# EAGLE design LampanRGBLed (EAGLE 5.06)
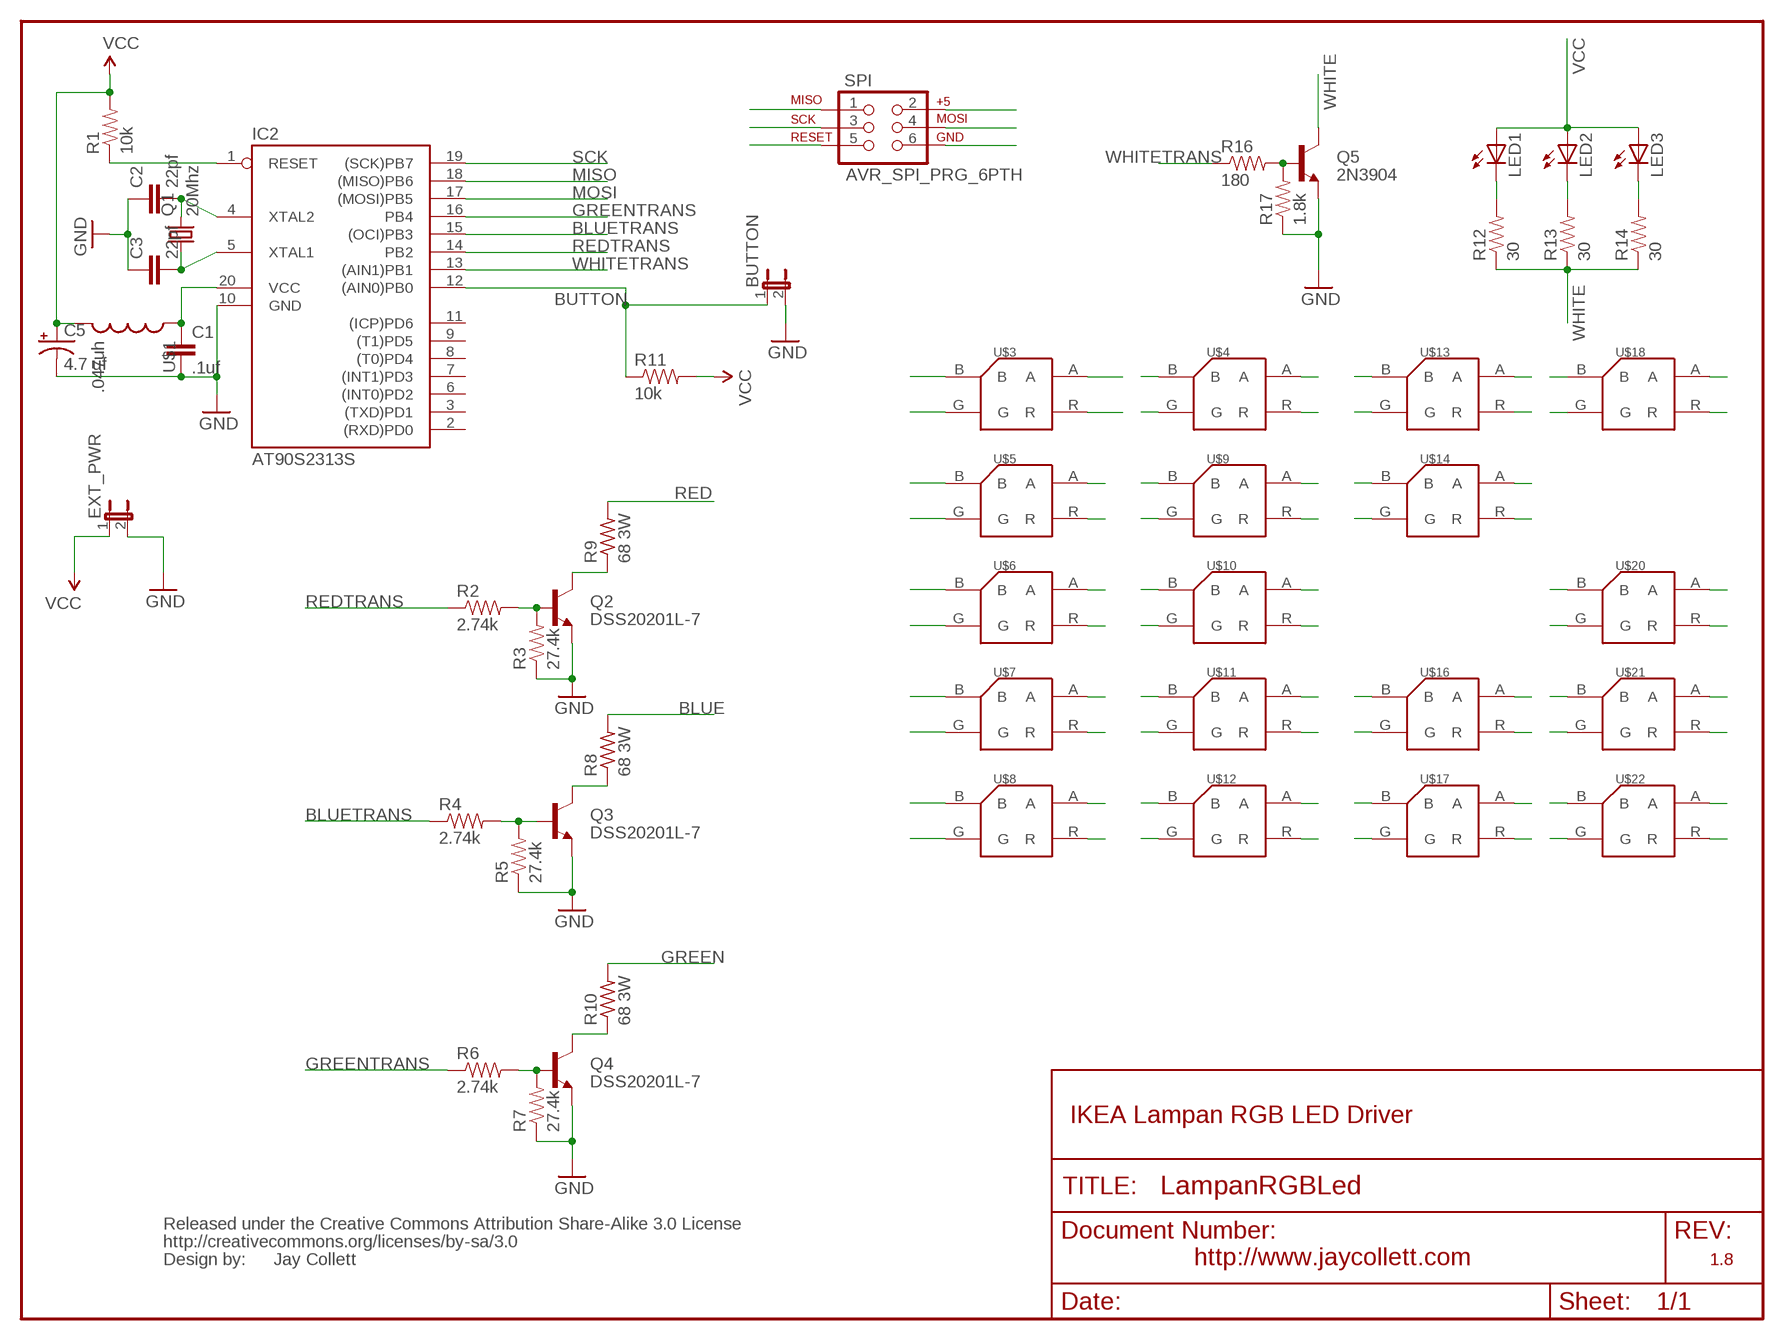
[diagram p0: schematic, sheet 1]

## Parts
BUTTON  JUMPER-2PTH  [1X02]
C1  .1uf  CAP0603-CAP  [0603-CAP]
C2  22pf  CAP0603-CAP  [0603-CAP]
C3  22pf  CAP0603-CAP  [0603-CAP]
C5  4.7 uf  CAP_POL1206  [EIA3216]
EXT_PWR  JUMPER-2PTH  [1X02]
IC2  AT90S2313S  [SO20L]
LED1  LED5MM  [LED5MM]
LED2  LED5MM  [LED5MM]
LED3  LED5MM  [LED5MM]
Q1  20Mhz  CRYSTALHC49UV  [HC49U-V]
Q2  DSS20201L-7  TRANSISTOR_NPNSOT23  [SOT23]
Q3  DSS20201L-7  TRANSISTOR_NPNSOT23  [SOT23]
Q4  DSS20201L-7  TRANSISTOR_NPNSOT23  [SOT23]
Q5  2N3904  TRANSISTOR_NPNSOT23  [SOT23]
R1  10k  RESISTOR  [0805]
R2  2.74k  RESISTOR  [0805]
R3  27.4k  RESISTOR  [0805]
R4  2.74k  RESISTOR  [0805]
R5  27.4k  RESISTOR  [0805]
R6  2.74k  RESISTOR  [0805]
R7  27.4k  RESISTOR  [0805]
R8  68 3W  R-US_0617/5V  [0617V]
R9  68 3W  R-US_0617/5V  [0617V]
R10  68 3W  R-US_0617/5V  [0617V]
R11  10k  RESISTOR  [0805]
R12  30  RESISTOR  [0805]
R13  30  RESISTOR  [0805]
R14  30  RESISTOR  [0805]
R16  180  RESISTOR  [0805]
R17  1.8k  RESISTOR  [0805]
SPI  AVR_SPI_PRG_6PTH  [2X3]
U$1  .047uh  INDUCTOR1210  [1210]
U$3  5MMRGBSUPERFLUXLED4PIN5MM  [4-PIN5MM]
U$4  5MMRGBSUPERFLUXLED4PIN5MM  [4-PIN5MM]
U$5  5MMRGBSUPERFLUXLED4PIN5MM  [4-PIN5MM]
U$6  5MMRGBSUPERFLUXLED4PIN5MM  [4-PIN5MM]
U$7  5MMRGBSUPERFLUXLED4PIN5MM  [4-PIN5MM]
U$8  5MMRGBSUPERFLUXLED4PIN5MM  [4-PIN5MM]
U$9  5MMRGBSUPERFLUXLED4PIN5MM  [4-PIN5MM]
U$10  5MMRGBSUPERFLUXLED4PIN5MM  [4-PIN5MM]
U$11  5MMRGBSUPERFLUXLED4PIN5MM  [4-PIN5MM]
U$12  5MMRGBSUPERFLUXLED4PIN5MM  [4-PIN5MM]
U$13  5MMRGBSUPERFLUXLED4PIN5MM  [4-PIN5MM]
U$14  5MMRGBSUPERFLUXLED4PIN5MM  [4-PIN5MM]
U$16  5MMRGBSUPERFLUXLED4PIN5MM  [4-PIN5MM]
U$17  5MMRGBSUPERFLUXLED4PIN5MM  [4-PIN5MM]
U$18  5MMRGBSUPERFLUXLED4PIN5MM  [4-PIN5MM]
U$20  5MMRGBSUPERFLUXLED4PIN5MM  [4-PIN5MM]
U$21  5MMRGBSUPERFLUXLED4PIN5MM  [4-PIN5MM]
U$22  5MMRGBSUPERFLUXLED4PIN5MM  [4-PIN5MM]
U$23  CREATIVE_COMMONS  [CREATIVE_COMMONS]

## Nets
BLUE: R8.2 U$3.B U$4.B U$5.B U$6.B U$7.B U$8.B U$9.B U$10.B U$11.B U$12.B U$13.B U$14.B U$16.B U$17.B U$18.B U$20.B U$21.B U$22.B
BLUETRANS: IC2.15((OCI)PB3) R4.1
BUTTON: BUTTON.1 IC2.12((AIN0)PB0) R11.1
GND: BUTTON.2 C1.2 C2.1 C3.1 C5.C(-) EXT_PWR.2 IC2.10(GND) Q2.2(E) Q3.2(E) Q4.2(E) Q5.2(E) R3.1 R5.1 R7.1 R17.1 SPI.6
GREEN: R10.2 U$3.G U$4.G U$5.G U$6.G U$7.G U$8.G U$9.G U$10.G U$11.G U$12.G U$13.G U$14.G U$16.G U$17.G U$18.G U$20.G U$21.G U$22.G
GREENTRANS: IC2.16(PB4) R6.1
MISO: IC2.18((MISO)PB6) SPI.1
MOSI: IC2.17((MOSI)PB5) SPI.4
N$1: Q2.1(B) R2.2 R3.2
N$2: Q3.1(B) R4.2 R5.2
N$3: Q4.1(B) R6.2 R7.2
N$4: C2.2 IC2.4(XTAL2) Q1.2
N$5: C3.2 IC2.5(XTAL1) Q1.1
N$6: Q2.3(C) R9.1
N$7: Q3.3(C) R8.1
N$8: Q4.3(C) R10.1
N$9: C1.1 IC2.20(VCC) U$1.1
N$10: LED1.K(C) R12.2
N$11: LED2.K(C) R13.2
N$12: LED3.K(C) R14.2
N$14: Q5.1(B) R16.2 R17.2
RED: R9.2 U$3.R U$4.R U$5.R U$6.R U$7.R U$8.R U$9.R U$10.R U$11.R U$12.R U$13.R U$14.R U$16.R U$17.R U$18.R U$20.R U$21.R U$22.R
REDTRANS: IC2.14(PB2) R2.1
RST: IC2.1(RESET) R1.1 SPI.5
SCK: IC2.19((SCK)PB7) SPI.3
VCC: C5.A(+) EXT_PWR.1 LED1.A LED2.A LED3.A R1.2 R11.2 SPI.2 U$1.2 U$3.A U$4.A U$5.A U$6.A U$7.A U$8.A U$9.A U$10.A U$11.A U$12.A U$13.A U$14.A U$16.A U$17.A U$18.A U$20.A U$21.A U$22.A
WHITE: Q5.3(C) R12.1 R13.1 R14.1
WHITETRANS: IC2.13((AIN1)PB1) R16.1
Unconnected: IC2.2((RXD)PD0) IC2.3((TXD)PD1) IC2.6((INT0)PD2) IC2.7((INT1)PD3) IC2.8((T0)PD4) IC2.9((T1)PD5) IC2.11((ICP)PD6)

## Notes on the sheet
- IKEA Lampan RGB LED Driver
- Jay Collett | http://www.jaycollett.com | 1.8

## Library data of the parts
BUTTON EXT_PWR = SparkFun:JUMPER-2: Jumper Basic 0.1" spaced jumper. Use with breakaway headers.
C1-C3 = SparkFun:CAP: Capacitor Standard 0603 ceramic capacitor, and 0.1" leaded capacitor.
C5 = SparkFun:CAP_POL: Capacitor Polarized These are standard SMD and PTH capacitors. Normally 10uF, 47uF, and 100uF in electrolytic and tantalum varieties. Always verify the external diameter of the through hole cap, it varies with capacity, voltage, and manufacturer. The EIA devices should be standard.
IC2 = atmel:AT90S2313: MICROCONTROLLER 2 Kbytes FLASH 128 bytes SRAM 128 bytes EEPROM UART
LED1-LED3 = SparkFun:LED: LEDs Standard schematic elements and footprints for 5mm, 3mm, 1206, and 0603 sized LEDs. 5mm - Spark Fun Electronics SKU : COM-00529 (and others)
Q1 = SparkFun:CRYSTAL: Crystals Various standard crystals. Proven footprints. Spark Fun Electronics SKU : COM-00534
Q2-Q5 = SparkFun:TRANSISTOR_NPN: Transistor NPN BJT configuration in SOT23 package. MMBT2222 is the common NPN we use. Double check BCE configuration again layout.
R1-R7 R11-R14 R16 R17 = SparkFun:RESISTOR: Resistor Basic schematic elements and footprints for 0603, 1206, and PTH 1/10th watt (small) resistors.
R8-R10 = rcl:R-US_: RESISTOR, American symbol
SPI = SparkFun:AVR_SPI_PRG_6: AVR ISP 6 Pin This is the reduced ISP connector for AVR programming. Common on Arduino. This footprint will take up less PCB space and can be used with a 10-pin to 6-pin adapter such as SKU: BOB-08508
U$1 = SparkFun:INDUCTOR: Inductors Basic Inductor/Choke - 0603 and 1206. Footprints are not proven and vary greatly between part numbers.
U$3-U$14 U$16-U$18 U$20-U$22 = JayCollett-com:5MMRGBSUPERFLUXLED: Custom Eagle Part for 5MM RGB Super Flux LEDs I purchased off EBay. Seller store is bestshop2008hk.
U$23 = SparkFun:CREATIVE_COMMONS

## Board
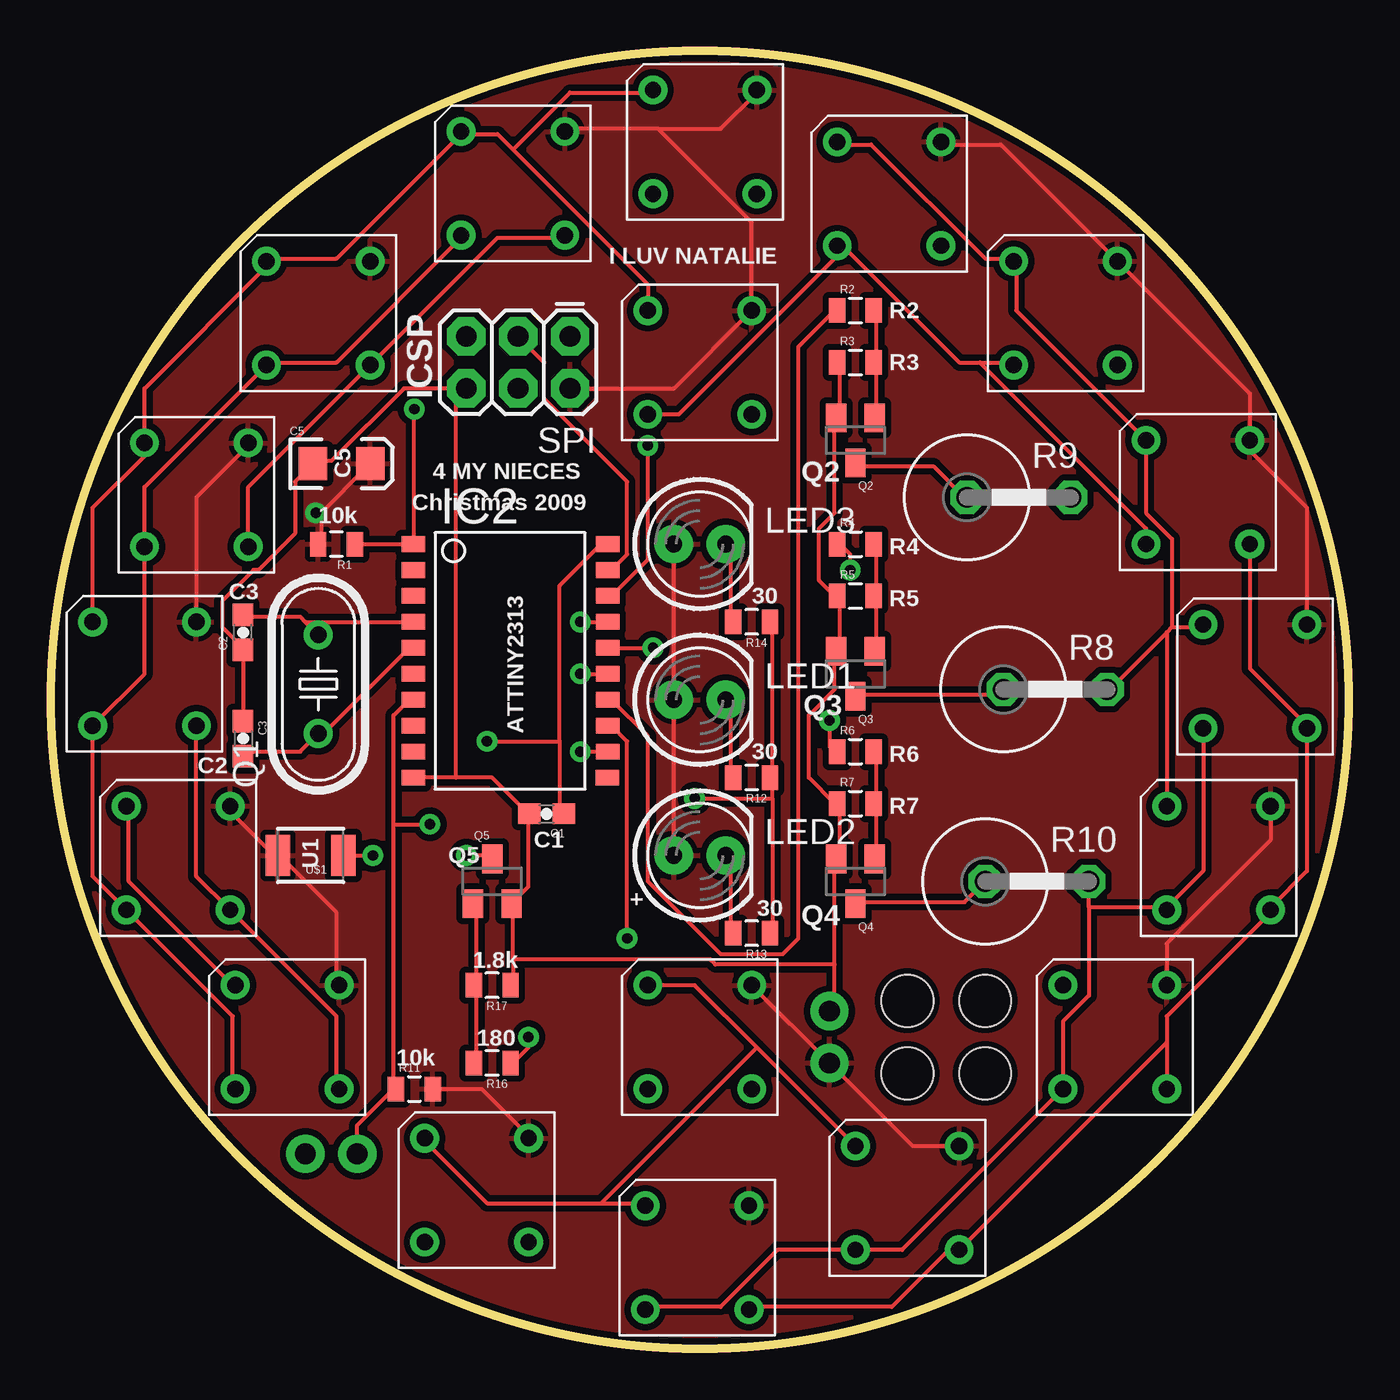
[diagram p1: board, top side]
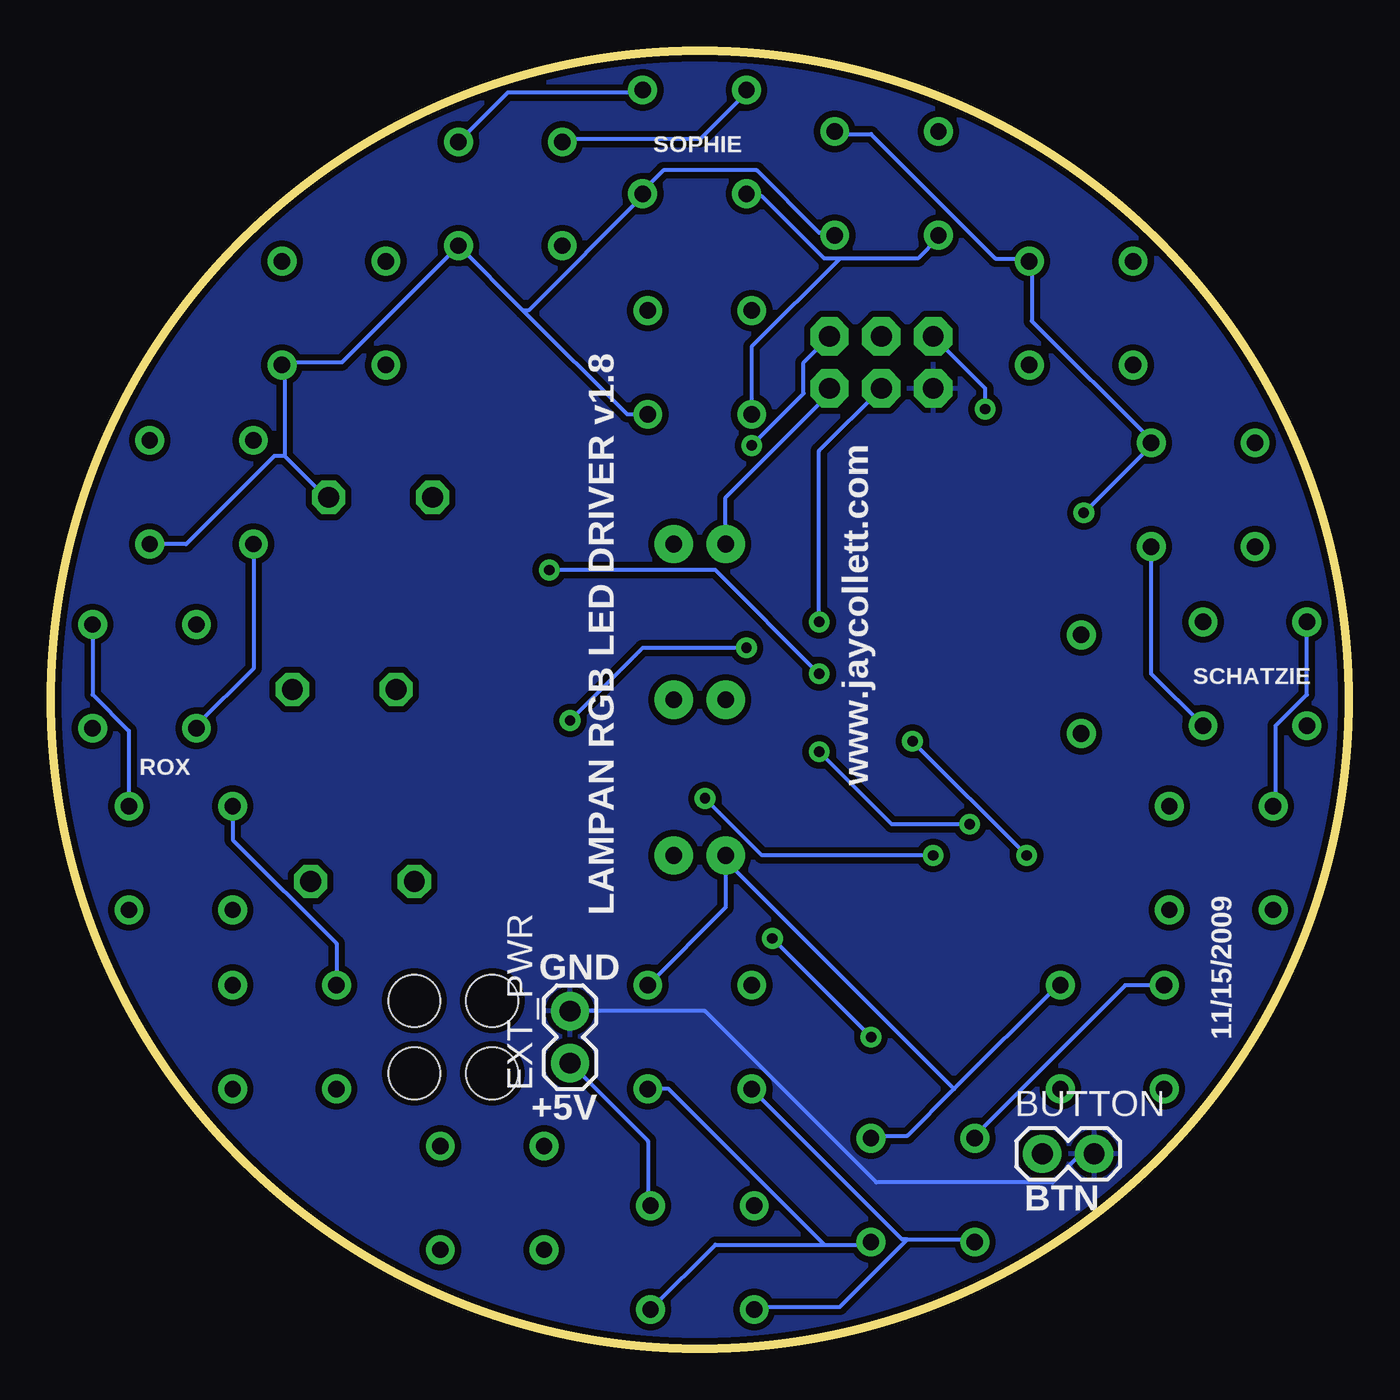
[diagram p2: board, bottom side, seen from below]

Size 63.5 x 63.5 mm. Coordinates in mm from the lower left corner, seen from the top.
Outline: circle at 31.75,31.75 radius 31.75
Copper layers (1*16): Top 0.035mm / dielectric 1.5mm / Bottom 0.035mm
Design rules "SparkFun": minimum track width 8mil, minimum drill 20mil, track to track 8mil, track to pad 8mil, pad to pad 8mil, via to via 8mil, smd to smd 8mil, copper to edge 10mil, drill to drill 8mil, minimum pad ring 12mil, minimum via ring 10mil, stop-mask expansion 4mil, vias tented up to drill 25mil, thermal gap 10mil
Holes 2.54 mm at 41.91,17.02 41.91,13.46 45.72,17.02 45.72,13.46

### Footprints (pad centres in the part's own frame; a part is rotated, then mirrored left to right if it is on the bottom)
1X02 = drill 1.016 pad 1.88 round: 1 0,0; 2 2.54,0
0603-CAP = smd 1.1 x 1: 1 -0.85,0; 2 0.85,0
EIA3216 = smd 1.4 x 1.6: A 1.4,0; C -1.4,0
SO20L = smd 0.762 x 1.143: 1 -5.08,-5.131; 2 -3.81,-5.131; 3 -2.54,-5.131; 4 -1.27,-5.131; 5 0,-5.131; 6 1.27,-5.131; 7 2.54,-5.131; 8 3.81,-5.131; 9 5.08,-5.131; 10 6.35,-5.131; 11 6.35,4.369; 12 5.08,4.394; 13 3.81,4.394; 14 2.54,4.394; 15 1.27,4.394; 16 0,4.394; 17 -1.27,4.394; 18 -2.54,4.394; 19 -3.81,4.394; 20 -5.08,4.394
LED5MM = drill 0.813 pad 1.88 round: A -1.27,0; K 1.27,0
HC49U-V = drill 0.813 round: 1 -2.413,0; 2 2.413,0
SOT23 = smd 1 x 1.4: 1 -0.95,-1.1; 2 0.95,-1.1; 3 0,1.1
0805 = smd 0.8 x 1.2: 1 -0.9,0; 2 0.9,0
0617V = drill 1.016 octagon: 1 -2.54,0; 2 2.54,0
2X3 = drill 1.016 pad 1.88 octagon: 1 0,0; 2 0,2.54; 3 2.54,0; 4 2.54,2.54; 5 5.08,0; 6 5.08,2.54
1210 = smd 1.2 x 2: 1 -1.6,0; 2 1.6,0
4-PIN5MM = drill 0.8 round: A 2.54,2.54; B -2.54,2.54; G -2.54,-2.54; R 2.54,-2.54

### Placement (x,y rotation side)
BUTTON  14.99,9.53 0 bottom
C1  24.26,26.16 180 top
C2  9.4,35.05 90 top
C3  9.4,29.84 270 top
C5  14.22,43.31 0 top
EXT_PWR  38.1,13.97 90 bottom
IC2  22.86,34.29 270 top
LED1  31.75,31.75 0 top
LED2  31.75,24.13 0 top
LED3  31.75,39.37 0 top
Q1  13.08,32.51 90 top
Q2  39.37,44.45 180 top
Q3  39.37,33.02 180 top
Q4  39.37,22.86 180 top
Q5  21.59,22.86 0 top
R1  13.97,39.37 180 top
R2  39.37,50.8 0 top
R3  39.37,48.26 0 top
R4  39.37,39.37 0 top
R5  39.37,36.83 0 top
R6  39.37,29.21 0 top
R7  39.37,26.67 0 top
R8  49.15,32.26 0 top
R9  47.37,41.66 0 top
R10  48.26,22.86 0 top
R11  17.78,12.7 0 top
R12  34.29,27.94 180 top
R13  34.29,20.32 180 top
R14  34.29,35.56 180 top
R16  21.59,13.97 180 top
R17  21.59,17.78 180 top
SPI  25.4,49.53 180 top
U$1  12.7,24.13 180 top
U$3  11.56,15.24 0 top
U$4  57.15,24 0 top
U$5  52.07,15.24 0 top
U$6  41.91,7.37 0 top
U$7  20.83,7.75 0 top
U$8  7.11,41.78 0 top
U$9  58.93,32.89 0 top
U$10  56.13,41.91 0 top
U$11  49.66,50.67 0 top
U$12  31.62,4.44 0 top
U$13  4.57,33.02 0 top
U$14  31.75,15.24 0 top
U$16  31.75,48.26 0 top
U$17  6.22,24 0 top
U$18  13.08,50.67 0 top
U$20  41.02,56.52 0 top
U$21  32,59.05 0 top
U$22  22.61,57.02 0 top
U$23  31.62,4.44 0 top

### Tracks (layer width: path | path; a pad name or v marks a point on that pad's centre or on a via)
BLUE
  Top 0.203: U$14.B 31.5,17.78 34.54,14.73 | 34.54,14.73 U$6.B | 26.92,7.11 21.34,7.11 18.29,10.16 U$7.B | 26.92,7.11 28.96,7.11 U$12.B | U$17.B 3.81,26.42 3.81,22.86 8.89,17.78 U$3.B | 26.92,7.11 34.54,14.73 | 54.86,35.31 56.39,35.31 U$9.B | 54.61,35.05 51.82,32.26 R8.2 | 54.86,35.31 54.61,35.05 | 54.86,35.31 54.86,39.62 53.59,40.89 U$10.B 47.24,50.8 47.24,53.09 U$11.B 46.99,53.34 45.72,53.34 40.13,58.93 38.61,58.93 U$20.B | 54.61,35.05 U$4.B | U$16.B 29.21,52.07 22.61,58.67 | 22.61,58.67 21.84,59.44 20.07,59.44 | 22.61,58.67 25.4,61.47 29.46,61.47 U$21.B | 20.07,59.44 13.97,53.34 10.67,53.34 U$18.B 10.67,53.09 4.57,46.99 U$8.B 4.57,43.69 2.03,41.15 U$13.B | 20.07,59.44 U$22.B
  Bottom 0.203: U$13.B 2.03,32 3.56,30.48 3.56,26.67 U$17.B | U$3.B 10.92,17.78 18.29,10.41 U$7.B | U$5.B 49.53,19.81 54.61,24.89 U$4.B | U$20.B 38.35,59.18 31.75,59.18 29.46,61.47 U$21.B
BLUETRANS  (via drill 0.51)
  Top 0.203: v39.12,38.1 39.12,38.86 38.61,39.37 R4.1 | v25.91,33.02 IC2.15
  Bottom 0.203: v25.91,33.02 30.99,38.1 v39.12,38.1
BUTTON  (via drill 0.51)
  Top 0.203: 17.53,31.75 16.76,30.99 16.76,25.65 | 16.76,12.7 16.76,25.65 | 16.76,12.7 14.99,10.92 BUTTON.1 | 16.76,12.7 R11.1 | 16.76,25.65 v18.54,25.65 | v25.91,29.21 IC2.12
  Bottom 0.203: v25.91,29.21 22.35,25.65 v18.54,25.65
GND
  Top 0.203: 23.37,26.16 23.37,22.61 22.61,21.84 Q5.2 22.61,21.59 22.61,19.05 | 19.81,27.94 21.59,27.94 23.37,26.16 | 19.81,27.94 IC2.10 | 23.37,26.16 C1.2 | 22.61,19.05 22.61,17.78 R17.1 | C3.1 C2.1 9.4,34.29 8.38,35.31 8.38,36.58 9.91,38.1 10.16,38.1 11.94,39.88 11.94,42.42 12.7,43.18 C5.C 12.95,43.43 13.72,43.43 17.27,46.99 19.81,46.99 | 19.81,27.94 19.81,46.99 | 19.81,46.99 SPI.6 | R3.1 38.61,48.26 38.61,45.72 Q2.2 38.35,45.47 38.35,40.89 37.59,40.13 37.59,37.59 38.35,36.83 R5.1 38.61,36.83 38.61,34.29 Q3.2 38.35,34.04 38.35,32.26 37.08,30.99 37.08,27.94 38.35,26.67 R7.1 38.61,26.67 38.61,24.13 Q4.2 38.35,23.88 38.35,18.8 | 38.35,18.8 38.35,16.76 EXT_PWR.2 | 22.61,19.05 32.26,19.05 32.51,18.8 38.35,18.8
  Bottom 0.203: EXT_PWR.2 31.5,16.51 23.11,8.13 14.48,8.13 13.21,9.4 12.45,9.4 BUTTON.2
  pour Bottom (isolate 0.305): 30.48,0 31.75,0 arc344 22.86,1.27 arc14
GREEN
  Top 0.203: U$12.G 29.21,2.03 32.77,2.03 35.56,4.83 U$6.G 41.66,4.83 U$5.G 49.53,16 50.8,17.27 50.8,21.59 | 50.8,21.59 R10.2 | 54.61,21.59 50.8,21.59 | 54.61,21.59 56.39,23.37 U$9.G | 54.61,21.59 U$4.G | U$3.G 8.89,12.7 8.89,16.26 U$17.G 2.03,23.11 U$13.G 4.57,33.02 U$8.G 4.57,42.16 U$18.G 10.67,48.26 13.97,48.26 20.07,54.36 U$22.G | U$16.G 30.73,45.72 38.35,53.34 38.35,53.85 U$20.G 38.61,54.1 44.45,48.26 45.47,48.26 | 45.47,48.26 46.99,48.26 U$11.G | U$10.G 53.59,40.13 45.47,48.26
  Bottom 0.203: 21.59,5.33 21.84,5.33 U$14.G | 21.59,5.33 18.29,5.33 U$7.G | 21.59,5.33 24.89,2.03 28.96,2.03 U$12.G | U$10.G 53.59,33.27 56.39,30.48 U$9.G | 24.89,53.34 21.08,53.34 20.07,54.36 U$22.G | 24.89,53.34 25.65,53.34 28.7,56.39 29.46,56.39 U$21.G | U$16.G 29.21,49.02 24.89,53.34
GREENTRANS  (via drill 0.51)
  Top 0.203: v38.1,30.73 38.1,29.46 38.35,29.21 R6.1 | IC2.16 v29.46,34.29
  Bottom 0.203: v29.46,34.29 34.54,34.29 v38.1,30.73
MISO  (via drill 0.51)
  Top 0.203: v29.21,44.2 29.21,38.61 27.43,36.83 IC2.18
  Bottom 0.203: v29.21,44.2 26.67,46.74 26.67,48.26 SPI.1
MOSI  (via drill 0.51)
  Top 0.203: v25.91,35.56 IC2.17
  Bottom 0.203: v25.91,35.56 25.91,43.94 SPI.4
N$1
  Top 0.203: 40.39,48.26 40.39,50.8 R2.2 | 40.39,48.26 40.39,45.72 Q2.1 | 40.39,48.26 R3.2
N$2
  Top 0.203: 40.39,36.83 40.39,39.37 R4.2 | 40.39,36.83 40.39,34.29 Q3.1 | 40.39,36.83 R5.2
N$3
  Top 0.203: 40.39,26.67 40.39,29.21 R6.2 | 40.39,26.67 40.39,24.13 Q4.1 | 40.39,26.67 R7.2
N$4
  Top 0.203: 12.45,35.56 12.19,35.81 9.4,35.81 C2.2 | 12.45,35.56 Q1.2 | 12.45,35.56 IC2.4
N$5
  Top 0.203: C3.2 9.4,29.21 12.19,29.21 Q1.1 13.21,29.97 17.53,34.29 IC2.5
N$6
  Top 0.203: Q2.3 39.37,43.18 43.18,43.18 44.7,41.66 R9.1
N$7
  Top 0.203: Q3.3 39.37,32 46.23,32 46.48,32.26 R8.1
N$8
  Top 0.203: R10.1 44.7,21.84 39.37,21.84 Q4.3
N$9  (via drill 0.51)
  Top 0.203: 24.89,29.72 24.89,37.34 26.92,39.37 IC2.20 | 24.89,29.72 24.89,26.16 C1.1 | v21.34,29.72 24.89,29.72 | U$1.1 v15.75,24.13
  Bottom 0.203: v15.75,24.13 v21.34,29.72
N$10
  Top 0.203: LED1.K 33.27,31.5 33.27,27.94 R12.2
N$11
  Top 0.203: LED2.K 33.27,23.88 33.27,20.32 R13.2
N$12
  Top 0.203: LED3.K 33.27,39.12 33.27,35.56 R14.2
N$14
  Top 0.203: 20.83,17.78 20.83,13.97 R16.2 | 20.83,17.78 20.83,21.59 Q5.1 | 20.83,17.78 R17.2
RED
  Top 0.203: U$3.R 13.97,12.7 13.97,16.26 U$17.R 7.11,23.11 U$13.R | U$8.R 9.65,42.16 U$18.R 21.84,54.36 25.15,54.36 U$22.R | U$12.R 34.29,2.03 41.15,2.03 43.94,4.83 U$6.R 54.61,14.99 | 54.61,14.99 54.61,16.26 59.69,21.34 U$4.R 59.69,21.59 61.47,23.37 U$9.R 61.47,30.48 58.67,33.27 U$10.R | 54.61,14.99 U$5.R
  Bottom 0.203: U$13.R 9.65,33.02 U$8.R | 52.07,43.69 52.07,48.01 U$11.R 52.07,48.26 49.28,48.26 U$20.R 40.39,50.8 | 52.07,43.69 50.04,41.66 R9.2 | U$16.R 35.31,45.72 40.39,50.8 | 40.39,50.8 40.13,50.8 34.54,56.39 U$21.R 34.54,56.64 33.53,57.66 28.96,57.66 25.91,54.61 25.15,54.61 U$22.R | 25.65,5.08 30.99,5.08 U$12.R | 25.65,5.08 23.37,5.08 U$7.R | U$14.R 33.27,12.7 25.65,5.08 | 52.07,43.69 52.58,43.69 56.9,39.37 U$10.R
REDTRANS
  Top 0.203: IC2.14 27.43,31.75 29.21,29.97 29.21,22.86 32.77,19.3 35.81,19.3 36.58,20.07 36.58,49.02 38.35,50.8 R2.1
RST  (via drill 0.51)
  Top 0.203: R1.1 IC2.1 17.78,39.37 v17.78,45.97
  Bottom 0.203: v17.78,45.97 17.78,46.99 SPI.5
SCK
  Top 0.203: SPI.3 24.13,48.26 24.13,46.48 28.19,42.42 28.19,38.86 27.43,38.1 IC2.19
VCC  (via drill 0.51)
  Top 0.203: R11.2 21.08,12.7 23.37,10.41 U$7.A | U$17.A 8.64,26.42 10.92,24.13 U$1.2 11.18,24.13 13.97,21.34 13.97,17.78 U$3.A | LED2.A LED1.A LED3.A | U$14.A EXT_PWR.1 42.16,9.91 U$6.A | 13.21,40.89 13.21,39.37 R1.2 | 13.21,40.89 15.49,43.18 C5.A | U$13.A 7.11,41.66 9.65,44.2 U$8.A | v12.95,40.89 13.21,40.89 | 29.72,59.69 32.77,59.69 34.54,61.47 U$21.A | 29.72,59.69 25.15,59.69 U$22.A | 29.72,59.69 34.29,55.12 U$16.A 30.48,46.99 SPI.2 | U$5.A 54.61,19.81 59.69,24.89 U$4.A | U$20.A 43.69,58.93 46.48,58.93 U$11.A 58.67,46.74 U$10.A 58.67,43.94 61.47,41.15 U$9.A
  Bottom 0.203: 19.3,12.7 14.22,17.78 U$3.A | 19.3,12.7 21.59,10.41 23.37,10.41 U$7.A | EXT_PWR.1 34.29,10.16 34.29,7.11 U$12.A | 30.48,23.88 30.48,21.59 U$14.A | 19.3,12.7 30.48,23.88 | 30.48,23.88 LED2.A | v12.95,40.89 9.65,44.2 U$8.A 9.65,44.45 15.49,50.29 15.49,53.09 U$18.A 15.75,53.34 17.27,53.34 23.37,59.44 25.15,59.44 U$22.A | U$9.A 61.47,32 59.69,30.23 U$4.A | U$21.A 34.54,61.47 41.15,61.47 U$20.A | LED3.A 30.48,41.66 25.4,46.74 SPI.2
  pour Top (isolate 0.305): 30.48,0 31.75,0 arc344 22.86,1.27 arc14
WHITE  (via drill 0.51)
  Top 0.203: 35.31,26.92 35.31,27.94 | 35.31,26.92 35.31,20.32 R13.1 | 35.31,27.94 35.31,35.56 R14.1 | 35.31,27.94 R12.1 | v20.32,24.13 21.59,24.13 Q5.3 | v31.5,26.92 35.31,26.92
  Bottom 0.203: v20.32,24.13 28.7,24.13 v31.5,26.92
WHITETRANS  (via drill 0.51)
  Top 0.203: v28.19,20.07 28.19,29.72 27.43,30.48 IC2.13 | v23.37,15.24 23.37,14.73 22.61,13.97 R16.1
  Bottom 0.203: v23.37,15.24 v28.19,20.07

### Text on the board
tPlace: I LUV NATALIE | R2 | R3 | ICSP | C5 | Q2 | 4 MY NIECES | Christmas 2009 | 10k | R4 | C3 | 30 | R5 | Q3 | ATTINY2313 | C2 | 30 | R6 | R7 | C1 | U1 | Q5 | 30 | + | Q4 | 1.8k | 180 | 10k
bPlace: SOPHIE | SCHATZIE | ROX | www.jaycollett.com | LAMPAN RGB LED DRIVER v1.8 | GND | 11/15/2009 | +5V | BTN